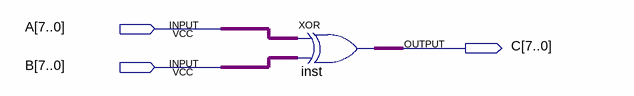
[diagram p0: schematic sheet]
// Quartus schematic EightBitXor.bdf as structural Verilog: 1 symbols, 3 pins
module EightBitXor (
  input  [7:0] A,
  input  [7:0] B,
  output [7:0] C
);

  assign C = A ^ B;  // XOR inst, 8 bits wide
endmodule
